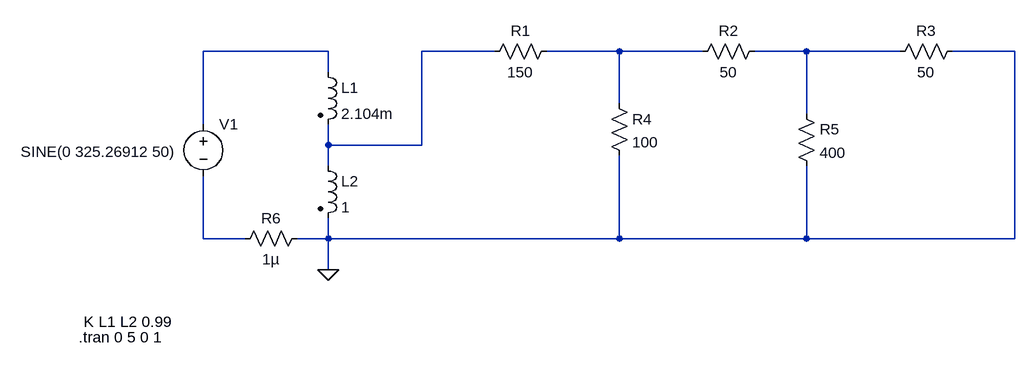
[diagram p0: schematic Expt1_Part2_Case1.asc]
Expt1_Part2_Case1.asc, the LTspice schematic file:
Version 4
SHEET 1 1416 680
WIRE 96 -224 -96 -224
WIRE 352 -224 240 -224
WIRE 544 -224 432 -224
WIRE 672 -224 544 -224
WIRE 832 -224 752 -224
WIRE 976 -224 832 -224
WIRE 1152 -224 1056 -224
WIRE 96 -192 96 -224
WIRE 544 -144 544 -224
WIRE 832 -128 832 -224
WIRE -96 -112 -96 -224
WIRE 96 -80 96 -112
WIRE 240 -80 240 -224
WIRE 240 -80 96 -80
WIRE 96 -48 96 -80
WIRE -96 64 -96 -32
WIRE -32 64 -96 64
WIRE 96 64 96 32
WIRE 96 64 48 64
WIRE 544 64 544 -64
WIRE 544 64 96 64
WIRE 832 64 832 -48
WIRE 832 64 544 64
WIRE 1152 64 1152 -224
WIRE 1152 64 832 64
WIRE 96 112 96 64
FLAG 96 112 0
SYMBOL ind2 80 -208 R0
SYMATTR InstName L1
SYMATTR Value 2.104m
SYMATTR Type ind
SYMBOL ind2 80 -64 R0
SYMATTR InstName L2
SYMATTR Value 1
SYMATTR Type ind
SYMBOL voltage -96 -128 R0
WINDOW 3 -281 58 Left 2
WINDOW 123 0 0 Left 0
WINDOW 39 0 0 Left 0
SYMATTR Value SINE(0 325.26912 50)
SYMATTR InstName V1
SYMBOL res 448 -240 R90
WINDOW 0 0 56 VBottom 2
WINDOW 3 32 56 VTop 2
SYMATTR InstName R1
SYMATTR Value 150
SYMBOL res 64 48 R90
WINDOW 0 0 56 VBottom 2
WINDOW 3 32 56 VTop 2
SYMATTR InstName R6
SYMATTR Value 1µ
SYMBOL res 528 -160 R0
SYMATTR InstName R4
SYMATTR Value 100
SYMBOL res 816 -144 R0
SYMATTR InstName R5
SYMATTR Value 400
SYMBOL res 768 -240 R90
WINDOW 0 0 56 VBottom 2
WINDOW 3 32 56 VTop 2
SYMATTR InstName R2
SYMATTR Value 50
SYMBOL res 1072 -240 R90
WINDOW 0 0 56 VBottom 2
WINDOW 3 32 56 VTop 2
SYMATTR InstName R3
SYMATTR Value 50
TEXT -280 192 Left 2 !K L1 L2 0.99
TEXT -288 216 Left 2 !.tran 0 5 0 1

The netlist it stands for:
* Expt1_Part2_Case1.asc
L1 N001 N002 2.104m
L2 N002 0 1
V1 N001 N005 SINE(0 325.26912 50)
R1 N003 N002 150
R6 0 N005 1µ
R4 N003 0 100
R5 N004 0 400
R2 N004 N003 50
R3 0 N004 50
K L1 L2 0.99
.tran 0 5 0 1
.backanno
.end